# Altium schematic sheet charger.SchDoc
size A3
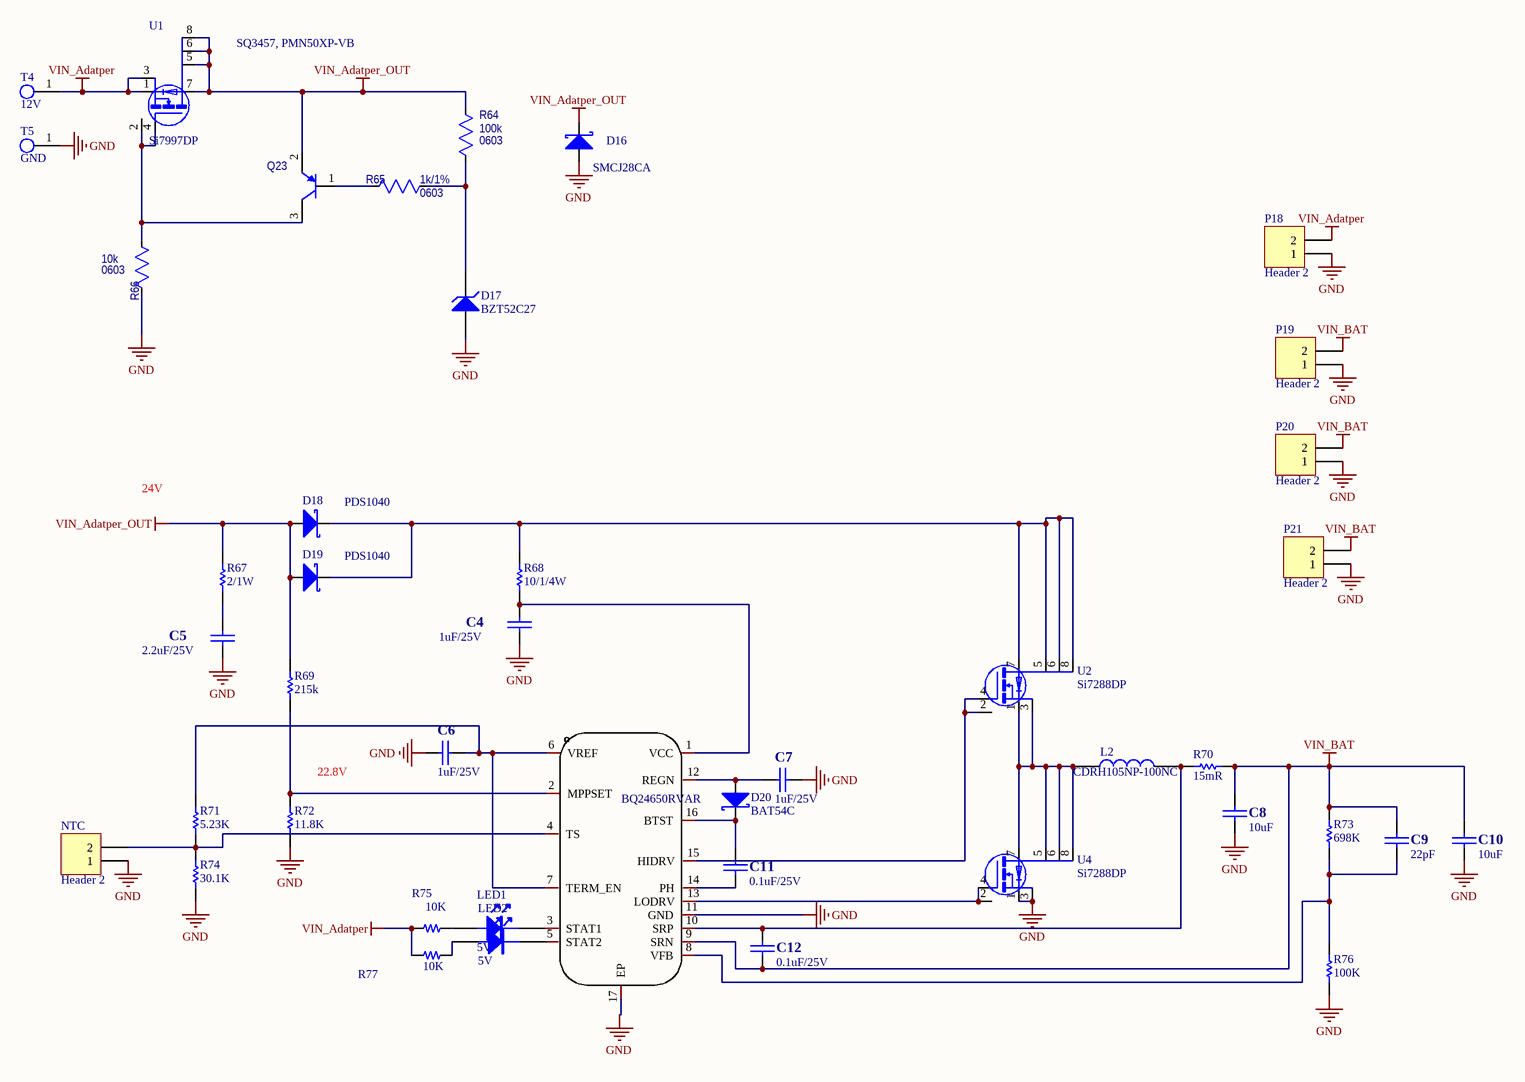
[diagram p0: charger.SchDoc]

## Parts
C4  1uF/25V  [0805C]
C5  2.2uF/25V  [1210C]
C6  1uF/25V  [0603C]
C7  1uF/25V  [0603C]
C8  10uF  [0603C]
C9  22pF  [0603C]
C10  10uF  [0603C]
C11  0.1uF/25V  [0603C]
C12  0.1uF/25V  [0603C]
D16  SMCJ28CA  [SMC]
D17  BZT52C27  [sod123]
D18  PDS1040  [SMA]
D19  PDS1040  [SMA]
D20  BAT54C
L2  CDRH105NP-100NC  [CDRH105]
LED1  5V  [0603LED]
LED2  5V  [0603LED]
NTC  Header 2  [HDR1X2]
P18  Header 2  [HDR1X2]
P19  Header 2  [HDR1X2]
P20  Header 2  [HDR1X2]
P21  Header 2  [HDR1X2]
Q23  MMBT4403-7-F  [SOT-23_3N_95P_240x300x100]  (value not drawn)
R64  value 100k  Package: 0603  [RESC1608X055N_0603]  (hidden comment: Resistor_0603)
R65  value 1k/1%  Package: 0603  [RESC1608X055N_0603]  (hidden comment: Resistor_0603)
R66  value 10k  Package: 0603  [RESC1608X055N_0603]  (hidden comment: Resistor_0603)
R67  2/1W  [2512R]
R68  10/1/4W  [1206R]
R69  215k  [0603R]
R70  15mR  [2512R]
R71  5.23K  [0603R]
R72  11.8K  [0603R]
R73  698K  [0603R]
R74  30.1K  [0603R]
R75  10K  [0603R]
R76  100K  [0603R]
R77  10K  [0603R]
T4  12V  [FIX-4.5]
T5  GND  [FIX-4.5]
U1  Si7997DP  [SC-70(PowerPAK)]
U2  Si7288DP  [SC-70(PowerPAK)]
U4  Si7288DP  [SC-70(PowerPAK)]
U5  BQ24650RVAR  [VQFN-16_L3.6-W3.6-P0.50-BL-EP]

## Nets
GND: C4.2 C5.2 C6.1 C7.2 C8.1 C10.1 D16.1(A) D17.1(A) NTC.1 P18.1 P19.1 P20.1 P21.1 R66.2 R72.2 R74.2 R76.2 T5.1 U4.1(S) U4.3(S) U5.11(GND) U5.17(EP)
VIN_Adatper: P18.2 R75.2 R77.2 T4.1 U1.1(S) U1.3(S)
VIN_Adatper_OUT: D16.2(K) D18.1(A) D19.1(A) Q23.2(E) R64.2 R67.1 R69.1 U1.5(D) U1.6(D) U1.7(D) U1.8(D)
VIN_BAT: C8.2 C9.2 C10.2 C12.1 P19.2 P20.2 P21.2 R70.2 R73.1 U5.9(SRN)
NetC4_1: C4.1 R68.2 U5.1(VCC)
NetC5_1: C5.1 R67.2
NetC6_2: C6.2 R71.1 U5.6(VREF) U5.7(TERM_EN)
NetC7_1: C7.1 D20.1(A) U5.12(REGN)
NetC9_1: C9.1 R73.2 R76.1 U5.8(VFB)
NetC11_1: C11.1 U5.14(PH)
NetC11_2: C11.2 D20.2(K) U5.16(BTST)
NetC12_2: C12.2 L2.2 R70.1 U5.10(SRP)
NetD17_2: D17.2(K) R64.1 R65.1
NetD18_2: D18.2(K) D19.2(K) R68.1 U2.5(D) U2.6(D) U2.7(D) U2.8(D)
NetL2_1: L2.1 U2.1(S) U2.3(S) U4.5(D) U4.6(D) U4.7(D) U4.8(D)
NetLED1_1: LED1.1 R75.1
NetLED1_2: LED1.2 U5.3(STAT1)
NetLED2_1: LED2.1 R77.1
NetNTC_2: NTC.2 R71.2 R74.1 U5.4(TS)
NetQ23_1: Q23.1(B) R65.2
NetQ23_3: Q23.3(C) R66.1 U1.2(G) U1.4(G)
NetR69_2: R69.2 R72.1 U5.2(MPPSET)
NetU2_2: U2.2(G) U2.4(G) U5.15(HIDRV)
NetU4_2: U4.2(G) U4.4(G) U5.13(LODRV)

Not connected (* = marked no-connect by the designer): LED2 2; U5 5(STAT2)

## Notes on the sheet
- SQ3457, PMN50XP-VB
- 24V
- (near R72) 22.8V

## Library data of the parts
C4-C12 = CAP: Capacitor
D16 D18-D20 = DIODE S: Schottky Diode
D17 = BZT52C12S-7-F: Zener Current: 5mA; Vz - Zener Voltage: 12V; Pd - Power Dissipation: 200mW; Zz - Zener Impedance: 40Ohms; Unit Weight: 0.000173oz; Voltage Temperature Coefficient: 0.25mV/C; Voltage Tolerance: 5%; Package Reference: SOD323-2; Minimum Operating Temperature: -65C; Packaging: Reel; Product Category: ZenerDiodes; Termination Style: SMD/SMT; Mounting Style: SMD/SMT; RoHS: True; Package / Case: SOD-323; Package Description: 2-Pin Surface Mount Device, Body 1.7 x 1.3 mm; Width: 1.4mm; Mounting Technology: SurfaceMount; Package URL: http://www.vishay.com/docs/71192/71192.pdf; Series: BZT52C12; Value: BZT52C12S-7-F
L2 = INDUCTOR
LED1 LED2 = LED
NTC P18-P21 = Header 2: Header, 2-Pin; LatestRevisionDate: 17-Jul-2002; LatestRevisionNote: Re-released for DXP Platform.; Publisher: Altium Limited
Q23 = OEM_Diodes_MMBT4403: Supplier 1: *; Supplier Part Number 1: *; Value: MMBT4403-7-F
R64 = Resistor_0603: PartNumber: RC0603FR-0716K9L; Power Rating: [power]; TempCo: [tempco]; Tolerance: tol; SupplierDescription: RES SMD 16.9K OHM 1% 1/10W 0603
R65 R66 = Resistor_0603: PartNumber: RC0603FR-071KL; Power Rating: [power]; TempCo: [tempco]; Tolerance: tol; SupplierDescription: RES SMD 1K OHM 1% 1/10W 0603
R67-R74 R76 = Res1: Resistor; Published: 8-Jun-2000; LatestRevisionDate: 17-Jul-2002; LatestRevisionNote: Re-released for DXP Platform.; PackageReference: AXIAL-0.3; Publisher: Altium Limited
R75 R77 = R: Value: 1k/1%
T4 T5 = TP
U1 U2 U4 = Si7997DP: Sia430DJ
U5 = BQ24650RVAR: Manufacturer: TI(德州仪器); Add into BOM: yes; Symbol: BQ24650RVAR; Device: BQ24650RVAR; Supplier: LCSC; Manufacturer Part: BQ24650RVAR; Supplier Part: C53712; JLCPCB Part Class: Extended Part; LCSC Part Name: BQ24650RVAR; Supplier Footprint: VQFN-16-EP(3.6x3.6); Datasheet: https://www.ti.com/cn/lit/gpn/bq24650; Convert to PCB: yes